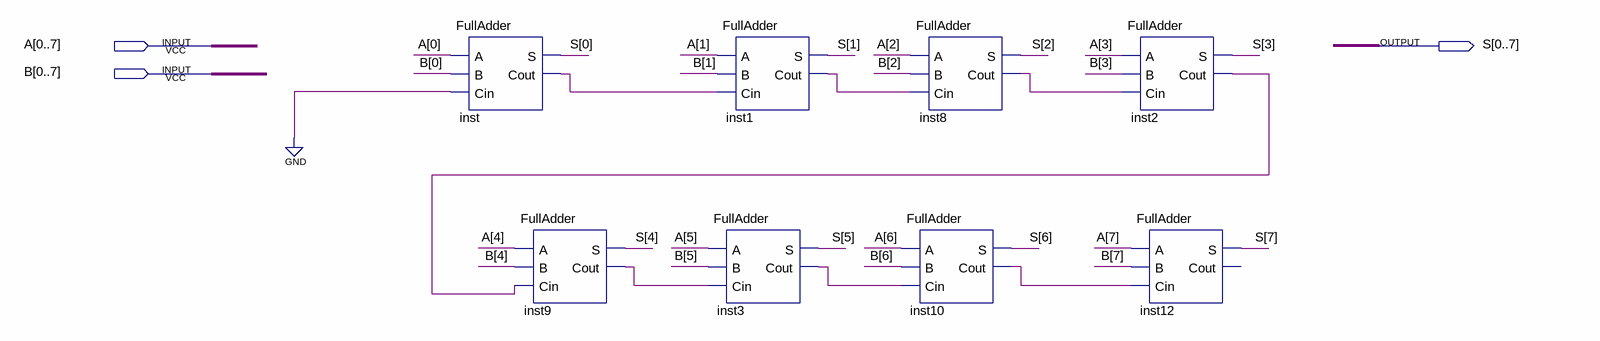
[diagram p0: schematic sheet]
// Quartus schematic Adder8bit.bdf as structural Verilog: 8 symbols, 3 pins
module Adder8bit (
  input  [0:7] A,
  input  [0:7] B,
  output [0:7] S
);

  wire inst1_cout, inst2_cout, inst3_cout, inst8_cout, inst9_cout, inst10_cout, inst_cout;

  FullAdder inst (.A(A[0]), .B(B[0]), .Cin(1'b0), .S(S[0]), .Cout(inst_cout));
  FullAdder inst9 (.A(A[4]), .B(B[4]), .Cin(inst2_cout), .S(S[4]), .Cout(inst9_cout));
  FullAdder inst1 (.A(A[1]), .B(B[1]), .Cin(inst_cout), .S(S[1]), .Cout(inst1_cout));
  FullAdder inst3 (.A(A[5]), .B(B[5]), .Cin(inst9_cout), .S(S[5]), .Cout(inst3_cout));
  FullAdder inst8 (.A(A[2]), .B(B[2]), .Cin(inst1_cout), .S(S[2]), .Cout(inst8_cout));
  FullAdder inst10 (.A(A[6]), .B(B[6]), .Cin(inst3_cout), .S(S[6]), .Cout(inst10_cout));
  FullAdder inst2 (.A(A[3]), .B(B[3]), .Cin(inst8_cout), .S(S[3]), .Cout(inst2_cout));
  FullAdder inst12 (.A(A[7]), .B(B[7]), .Cin(inst10_cout), .S(S[7]));  // open: Cout
endmodule
